# EAGLE design promini1via (EAGLE 9.6.2)
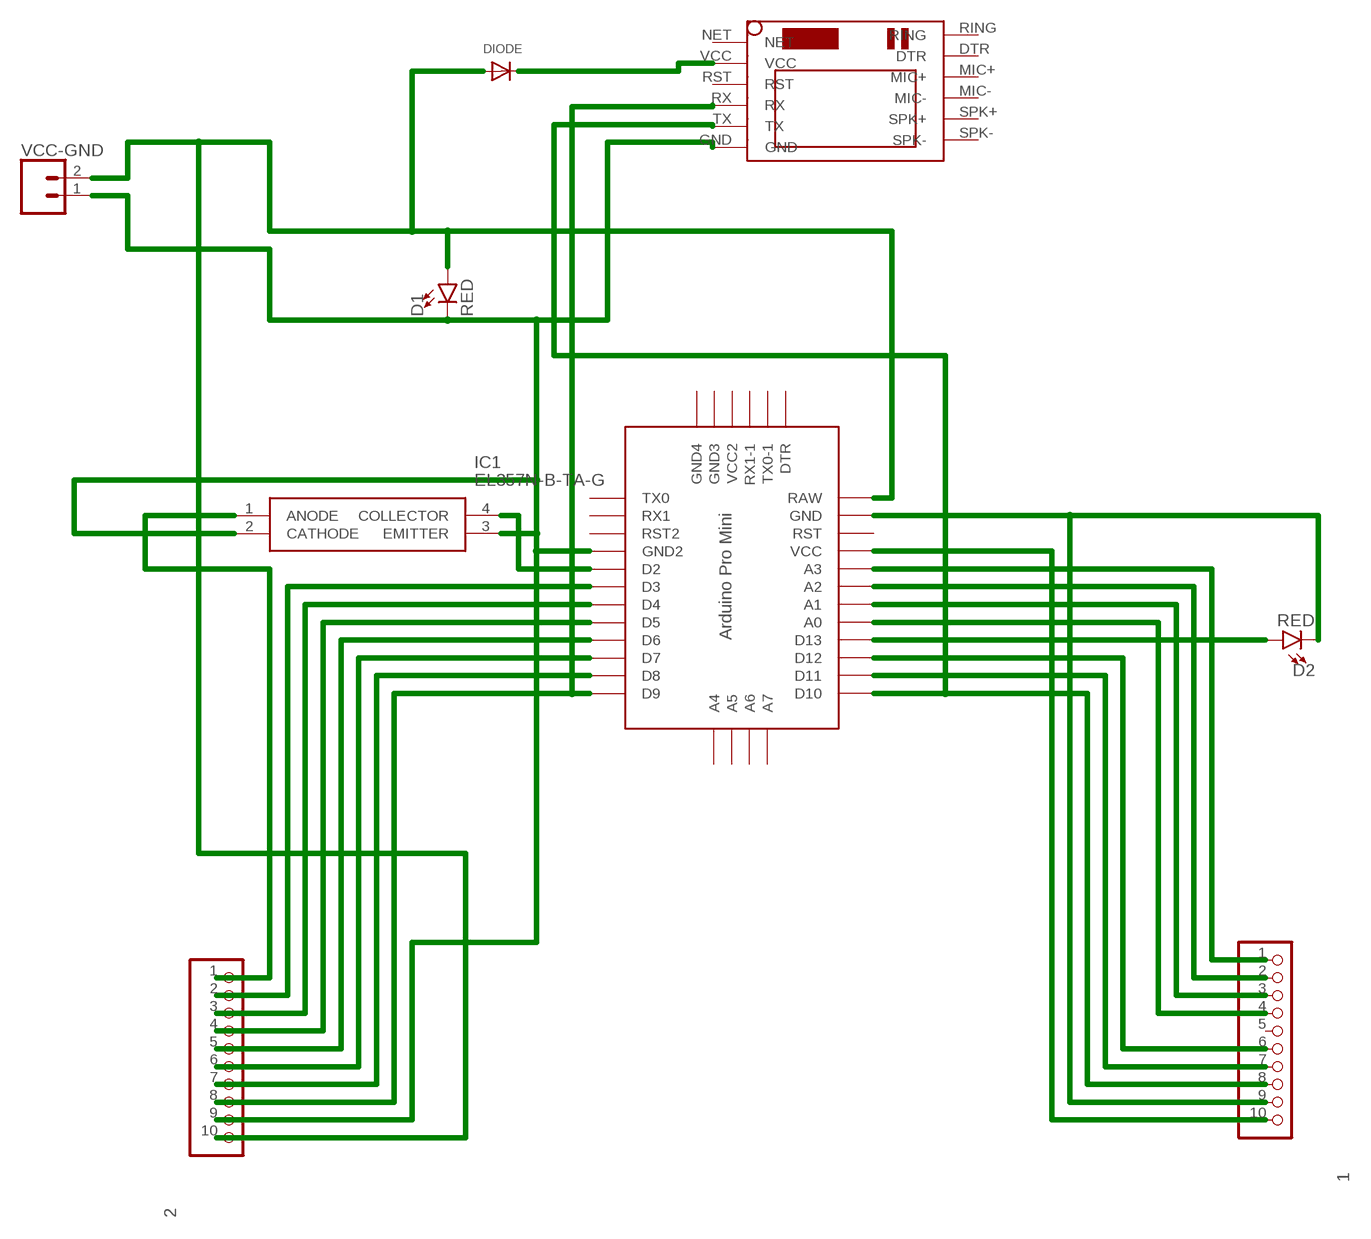
[diagram p0: schematic, sheet 1]

## Parts
1  PINHD-1X10  [1X10]
2  PINHD-1X10  [1X10]
D1  RED  LED-RED1206  [LED-1206]
D2  RED  LED-RED1206  [LED-1206]
DIODE  DIODESOD-323F  [SOD-323F]
IC1  EL357N-B-TA-G  [SOP254P700X200-4N]
PROMINI  PRO-MINI  [PRO-MINI]
U$1  SIM800LMODULE  [SIM800LMODULE]
VCC-GND  CONN_023.5MM  [SCREWTERMINAL-3.5MM-2]

## Nets
D2,D3,D4,D5-IO0,D6-IO2,D7-IO4,D8-IO5,D9-IO9,GND,VIN: 2.6 PROMINI.D7
N$1: 2.10 D1.A DIODE.A PROMINI.RAW VCC-GND.2
N$3: DIODE.C U$1.VCC
N$4: 1.10 PROMINI.VCC
N$5: IC1.4(COLLECTOR) PROMINI.D2
N$6: 2.8 PROMINI.D9 U$1.RX
N$8: 2.1 IC1.1(ANODE)
N$9: 2.2 PROMINI.D3
N$10: 2.3 PROMINI.D4
N$11: 2.4 PROMINI.D5
N$12: 2.5 PROMINI.D6
N$14: 2.7 PROMINI.D8
N$16: 1.1 PROMINI.A3
N$17: 1.2 PROMINI.A2
N$18: 1.3 PROMINI.A1
N$19: 1.4 PROMINI.A0
N$20: D2.A PROMINI.D13
N$21: 1.6 PROMINI.D12
N$22: 1.7 PROMINI.D11
N$23: 1.8 PROMINI.D10 U$1.TX
N$24: 1.9 D2.C PROMINI.GND
N$26: 2.9 D1.C IC1.2(CATHODE) IC1.3(EMITTER) PROMINI.GND1(GND2) U$1.GND VCC-GND.1
Unconnected: 1.5 PROMINI.A4 PROMINI.A5 PROMINI.A6 PROMINI.A7 PROMINI.DTR PROMINI.GND2(GND4) PROMINI.GND3 PROMINI.RST PROMINI.RST1(RST2) PROMINI.RX1 PROMINI.RX1-1 PROMINI.TX0 PROMINI.TX0-1 PROMINI.VCC1(VCC2) U$1.DTR U$1.MIC+ U$1.MIC- U$1.NET U$1.RING U$1.RST U$1.SPK+ U$1.SPK-

## Library data of the parts
1 2 = pinhead:PINHD-1X10: PIN HEADER
D1 D2 = SparkFun-LED:LED-RED: Red SMD LED Used in manufacturing of most products at SparkFun Packages: 0603 - SMD 0603 package [Product Link] <http://docs.avagotech.com/docs/AV02-0551EN> 0603 SMART - SMD 0603 SMART package ( more efficient and expensive)[Product Link] <http://www.osram-os.com/Graphics/XPic2/00077099_0.pdf> 1206 - SMD1206 package [Product Link] <https://www.sparkfun.com/datasheets/DevTools/LilyPad/Q150OVS4.pdff> SparkFun Products: Pro Mini 328 -5V <https://www.sparkfun.com/products/821> RedBoard <https://www.sparkfun.com/products/12757> IOIO-OTG <https://www.sparkfun.com/products/13613>; PROD_ID: DIO-09912
DIODE = adafruit:DIODE: Diode SMADIODE - SMA Surface Mount Package 20V 1A Schottky Diode Digikey: 641-1014-6-ND DO-1N4148 - Through Hole Small Current Diode SOD-123 20V 1 A (.5mV Vf) Schottky Diode - Digikey: MBRX120TPMSCT-ND SOD-323 10V 570mA (.38mV Vf, 3ns) Schottky Diode - Digikey: ZLLS410CT-ND SOD-523 30V 30mA Schottky Diode (RB751S-40TE61) - Digikey: RB751S-40TE61CT-ND SOT23-R/W - SOT23 Package (R = Solder Paste/Reflow Ovens, W = Hand-Soldering) BAT54Film 40V 300mA - Digikey: 497-7162-1-ND
IC1 = EL357N-B-TA-G:EL357N-B-TA-G: Optoisolator Transistor Output 3750Vrms 1 Channel 4-SOP (2.54mm) Source: Datasheet <https://datasheet.lcsc.com/szlcsc/1809192312_Everlight-Elec-EL357N-B-TA-G_C6649.pdf>; DESCRIPTION: Optoisolator Transistor Output 3750Vrms 1 Channel 4-SOP (2.54mm); HEIGHT: 2mm; MANUFACTURER_NAME: Everlight Elec; MANUFACTURER_PART_NUMBER: EL357N-B-TA-G
PROMINI = Arduino-clone:PRO-MINI: Arduion Pro Mini Clone V1.0 www.betemcu.cu
U$1 = SIM800LMODULE:SIM800LMODULE: SIM800L Module
VCC-GND = SparkFun-Retired:CONN_02: Multi connection point. Often used as Generic Header-pin footprint for 0.1 inch spaced/style header connections On any of the 0.1 inch spaced packages, you can populate with these: Break Away Headers - Straight <https://www.sparkfun.com/products/116> (PRT-00116) Break Away Male Headers - Right Angle <https://www.sparkfun.com/products/553> (PRT-00553) Female Headers <https://www.sparkfun.com/products/115> (PRT-00115) Break Away Headers - Machine Pin <https://www.sparkfun.com/products/117> (PRT-00117) Break Away Female Headers - Swiss Machine Pin <https://www.sparkfun.com/products/743> (PRT-00743) For SCREWTERMINALS and SPRING TERMINALS visit here: Screw Terimnals on SparkFun.com <https://www.sparkfun.com/search/results?term=Screw+Terminals> (5mm/3.5mm/2.54mm spacing) This device is also useful as a general connection point to wire up your design to another part of your project. Our various solder wires solder well into these plated through hole pads. Hook-Up Wire - Assortment (Stranded, 22 AWG) <https://www.sparkfun.com/products/11375> (PRT-11375) Hook-Up Wire - Assortment (Solid Core, 22 AWG) <https://www.sparkfun.com/products/11367> (PRT-11367) View the entire wire category on our website here <https://www.sparkfun.com/categories/141> Special notes: Molex polarized connector foot print use with: PRT-08233 with associated crimp pins and housings. 2.54_SCREWTERM for use with PRT-10571. 3.5mm Screw Terminal footprints for PRT-08084 5mm Screw Terminal footprints for use with PRT-08432; PROD_ID: CONN-08399

## Board
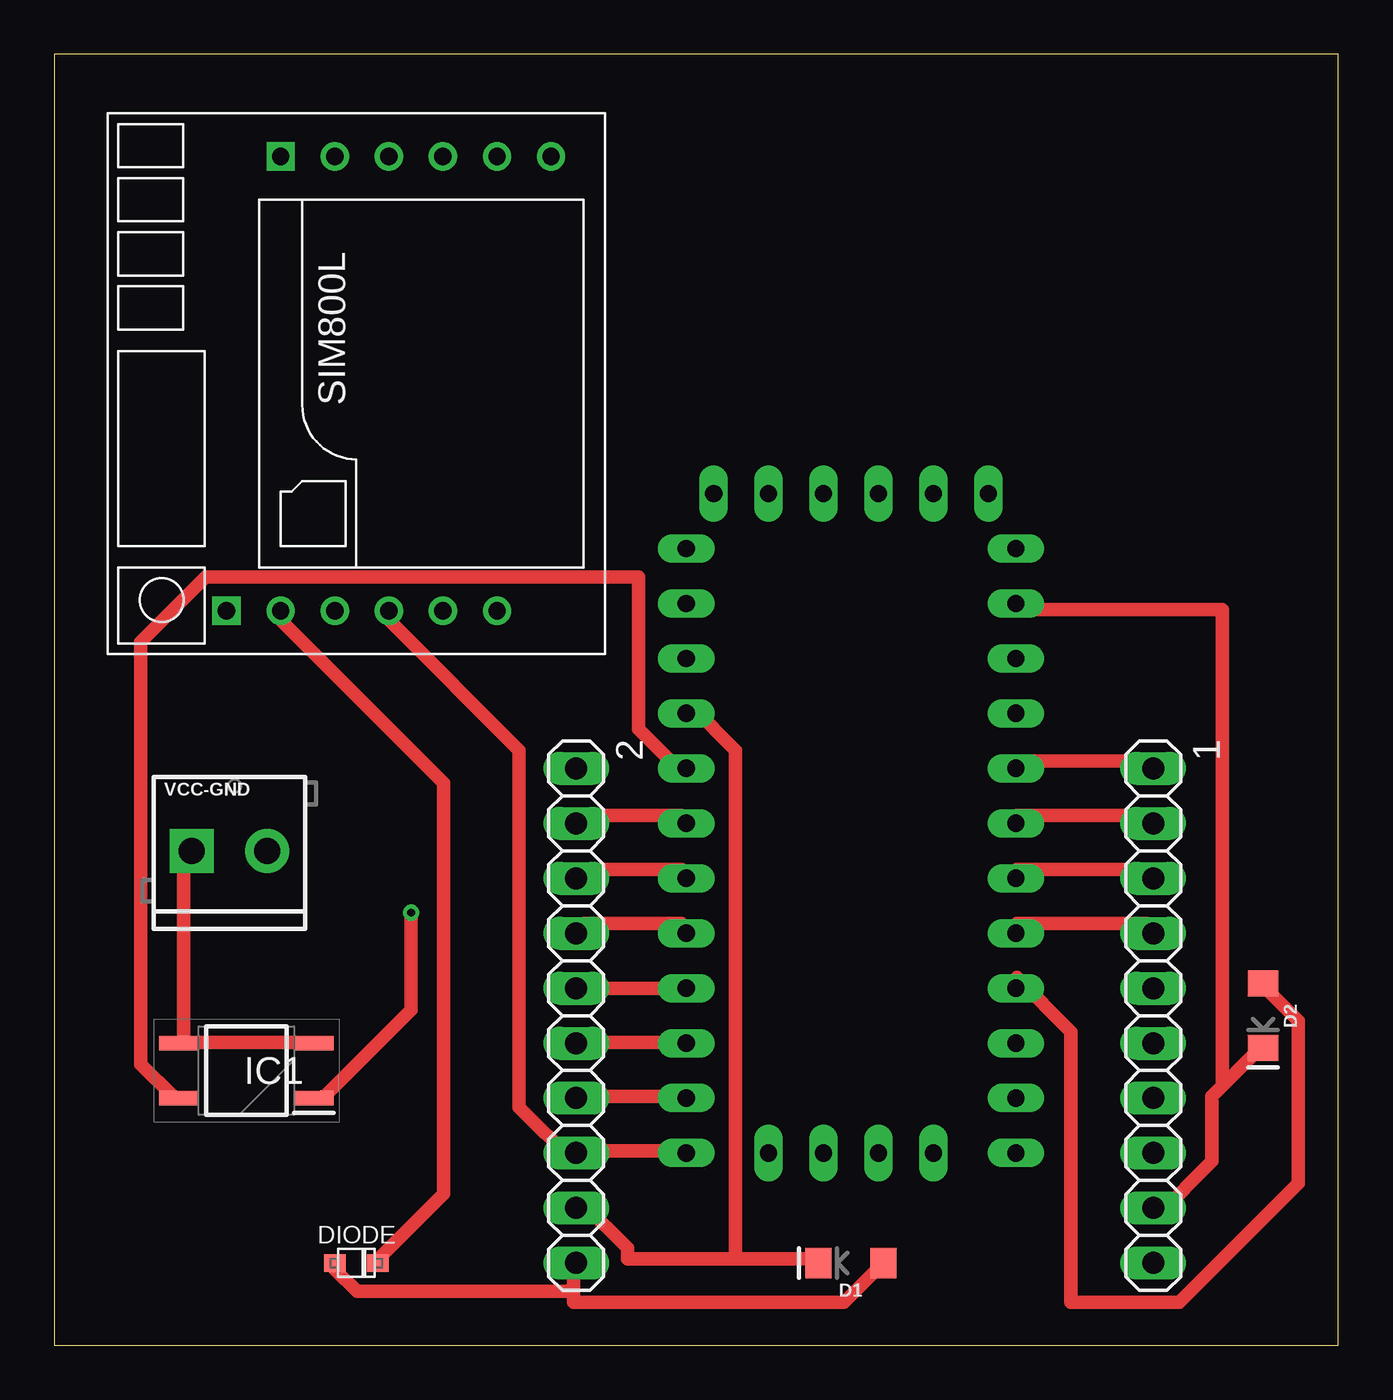
[diagram p1: board, top side]
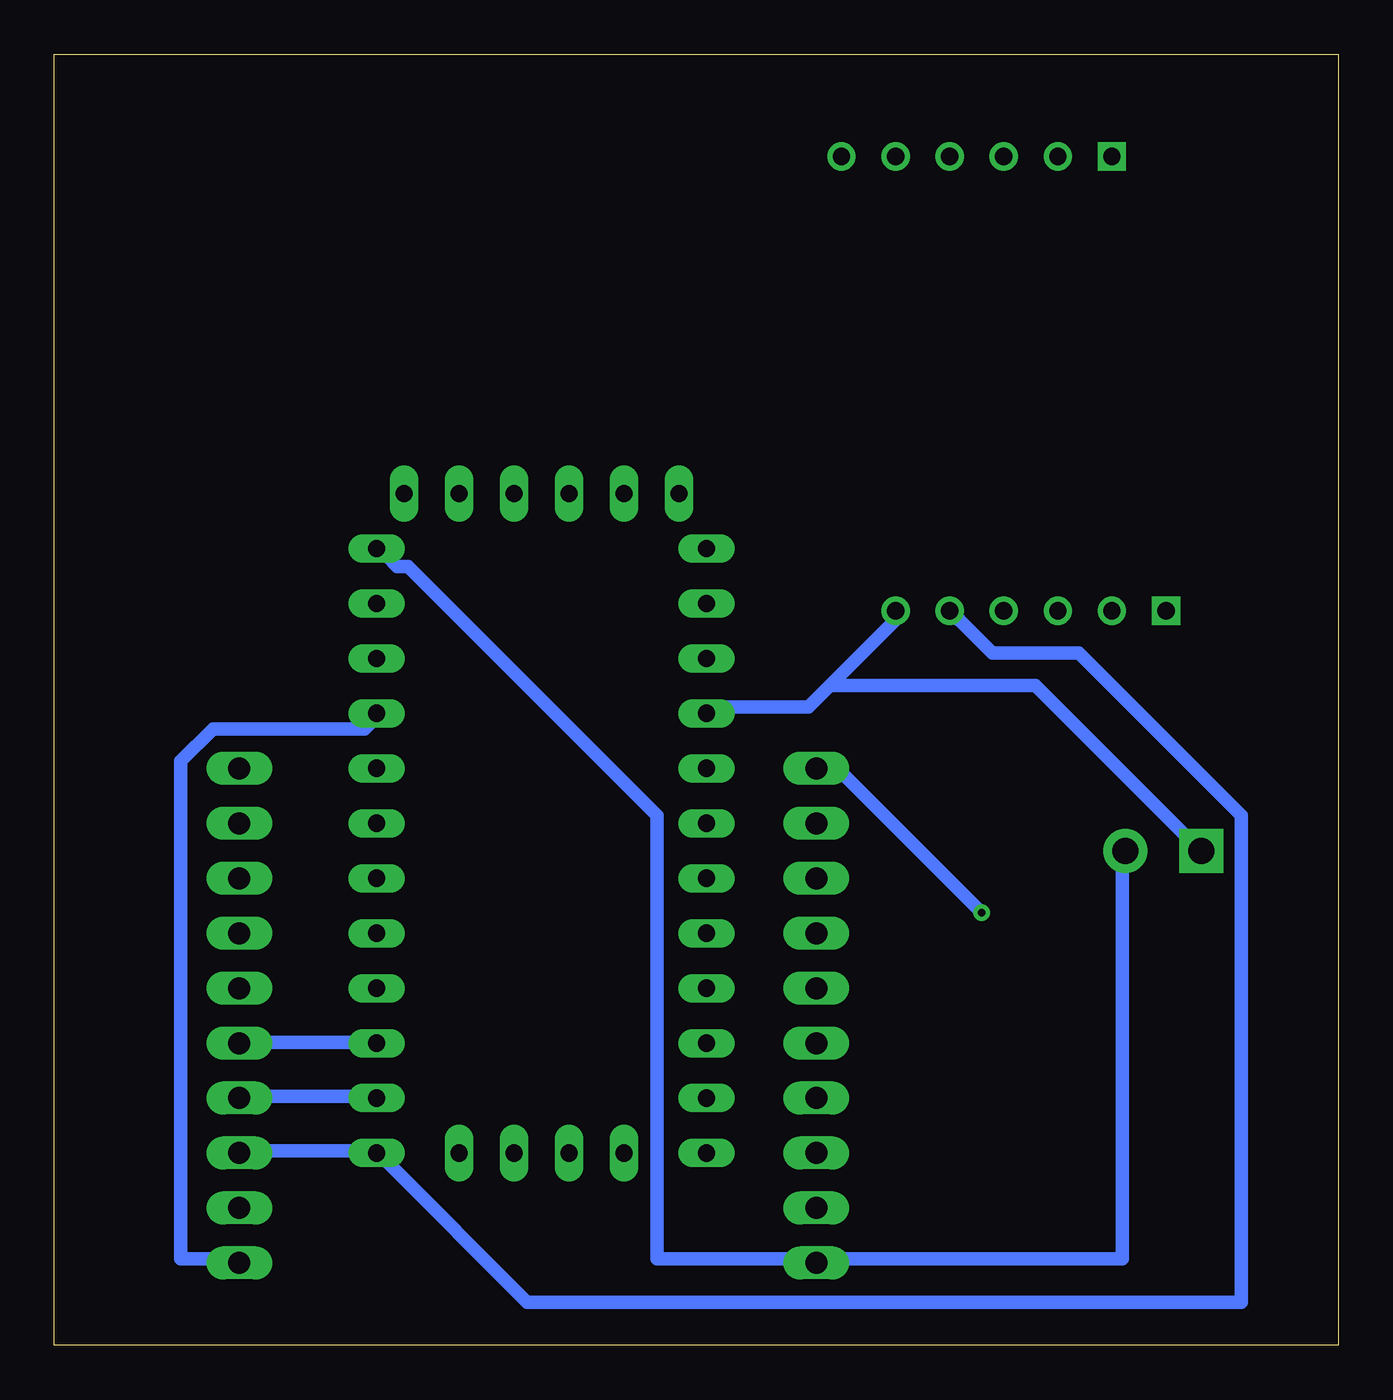
[diagram p2: board, bottom side, seen from below]

Size 59.36 x 59.68 mm. Coordinates in mm from the lower left corner, seen from the top.
Outline: 0,0 59.36,0 59.36,59.68 0,59.68 0,0
Copper layers (1*16): Top 0.035mm / dielectric 1.5mm / Bottom 0.035mm
Design rules "default *": minimum track width 25mil, minimum drill 0.35mm, track to track 20mil, track to pad 20mil, pad to pad 6mil, via to via 6mil, smd to smd 6mil, copper to edge 40mil, drill to drill 6mil, minimum pad ring 10mil, minimum via ring 8mil, stop-mask expansion 4mil, vias tented up to drill 0mil, thermal gap 10mil

### Footprints (pad centres in the part's own frame; a part is rotated, then mirrored left to right if it is on the bottom)
1X10 = drill 1.016 long: 1 -11.43,0; 2 -8.89,0; 3 -6.35,0; 4 -3.81,0; 5 -1.27,0; 6 1.27,0; 7 3.81,0; 8 6.35,0; 9 8.89,0; 10 11.43,0
LED-1206 = smd 1.2 x 1.4: A -1.5,0; C 1.5,0
SOD-323F = smd 1 x 0.8: A -1,0; C 1,0
SOP254P700X200-4N = smd 1.825 x 0.65: 1 -3.112,1.27; 2 -3.112,-1.27; 3 3.112,-1.27; 4 3.112,1.27
PRO-MINI = drill 0.8 long: A0 8.89,8.89; A1 8.89,11.43; A2 8.89,13.97; A3 8.89,16.51; A4 -2.54,-1.27; A5 0,-1.27; A6 2.54,-1.27; A7 5.08,-1.27; D2 -6.35,16.51; D3 -6.35,13.97; D4 -6.35,11.43; D5 -6.35,8.89; D6 -6.35,6.35; D7 -6.35,3.81; D8 -6.35,1.27; D9 -6.35,-1.27; D10 8.89,-1.27; D11 8.89,1.27; D12 8.89,3.81; D13 8.89,6.35; DTR 7.62,29.21; GND 8.89,24.13; GND1 -6.35,19.05; GND2 -5.08,29.21; GND3 -2.54,29.21; RAW 8.89,26.67; RST 8.89,21.59; RST1 -6.35,21.59; RX1 -6.35,24.13; RX1-1 2.54,29.21; TX0 -6.35,26.67; TX0-1 5.08,29.21; VCC 8.89,19.05; VCC1 0,29.21
SIM800LMODULE = drill 0.8: DTR 10.5,1; GND -10.5,-6.5; MIC+ 10.5,-1.5; MIC- 10.5,-4; RST -10.5,1; RX -10.5,-1.5; SPK+ 10.5,-6.5; SPK- 10.5,-9; TX -10.5,-4; VCC -10.5,3.5 | drill 0.8 square: NET -10.5,6; RING 10.5,3.5
SCREWTERMINAL-3.5MM-2 = drill 1.2 pad 2.032 square: 1 0,0 | drill 1.2 pad 2.032: 2 3.5,0

### Placement (x,y rotation side)
1  50.8,15.24 270 top
2  24.13,15.24 270 top
D1  36.83,3.81 180 top
D2  55.88,15.24 270 top
DIODE  13.97,3.81 0 top
IC1  8.89,12.7 180 top
PROMINI  35.56,10.16 0 top
U$1  13.97,44.45 90 top
VCC-GND  6.35,22.86 0 top

### Tracks (layer width: path | path; a pad name or v marks a point on that pad's centre or on a via)
D2,D3,D4,D5-IO0,D6-IO2,D7-IO4,D8-IO5,D9-IO9,GND,VIN
  Top 0.635: PROMINI.D7 29,14 24.5,14 2.6
N$1
  Top 0.635: 24,2.5 14,2.5 13,3.5 DIODE.A | 24,2.5 24,3.5 2.10 | 24,2.5 24,2 36.5,2 38,3.5 D1.A
  Bottom 0.635: PROMINI.RAW 44,36.5 43.5,36 43,36 31.5,24.5 31.5,4 24.5,4 2.10 24,4 10,4 10,22.5 VCC-GND.2
N$3
  Top 0.635: DIODE.C 15,4 18,7 18,26 10.5,33.5 U$1.VCC
N$4
  Bottom 0.635: PROMINI.VCC 44.5,29 45,28.5 52,28.5 53.5,27 53.5,4 51,4 1.10
N$5
  Top 0.635: IC1.4 5.5,11.5 4,13 4,32.5 7,35.5 27,35.5 27,28.5 29,26.5 PROMINI.D2
N$6
  Top 0.635: PROMINI.D9 29,9 24.5,9 2.8 24,8.5 21.5,11 21.5,27.5 15.5,33.5 U$1.RX
N$8  (via drill 0.35)
  Top 0.635: v16.5,20 16.5,15.5 12.5,11.5 IC1.1
  Bottom 0.635: v16.5,20 23,26.5 24,26.5 2.1
N$9
  Top 0.635: PROMINI.D3 29,24.5 24.5,24.5 2.2
N$10
  Top 0.635: PROMINI.D4 29,22 24.5,22 2.3
N$11
  Top 0.635: PROMINI.D5 29,19.5 24.5,19.5 2.4
N$12
  Top 0.635: PROMINI.D6 29,16.5 24.5,16.5 2.5
N$14
  Top 0.635: PROMINI.D8 29,11.5 24.5,11.5 2.7
N$16
  Top 0.635: PROMINI.A3 44.5,27 50.5,27 1.1
N$17
  Top 0.635: PROMINI.A2 44.5,24.5 50.5,24.5 1.2
N$18
  Top 0.635: PROMINI.A1 44.5,22 50.5,22 1.3
N$19
  Top 0.635: PROMINI.A0 44.5,19.5 50.5,19.5 1.4
N$20
  Top 0.635: D2.A 56,16.5 57.5,15 57.5,7.5 52,2 47,2 47,14.5 44.5,17 PROMINI.D13
N$21
  Bottom 0.635: PROMINI.D12 44.5,14 50.5,14 1.6
N$22
  Bottom 0.635: PROMINI.D11 44.5,11.5 50.5,11.5 1.7
N$23
  Bottom 0.635: U$1.TX 17.5,33.5 16,32 12,32 4.5,24.5 4.5,2 37.5,2 44,8.5 PROMINI.D10 44.5,9 50.5,9 1.8
N$24
  Top 0.635: 54,12 53.5,11.5 53.5,8.5 51,6 1.9 | 54,12 55.5,13.5 D2.C | 54,12 54,34 44.5,34 PROMINI.GND
N$26
  Top 0.635: 6,14 12,14 IC1.2 | 6,14 6,22.5 VCC-GND.1 | 6,14 IC1.3 | 31.5,4 26.5,4 26.5,4.5 24.5,6.5 2.9 | 31.5,4 35,4 D1.C | 31.5,4 31.5,27.5 29.5,29.5 PROMINI.GND1
  Bottom 0.635: 23.5,30.5 24.5,29.5 29,29.5 PROMINI.GND1 | 23.5,30.5 20.5,33.5 U$1.GND | 23.5,30.5 14,30.5 6.5,23 VCC-GND.1